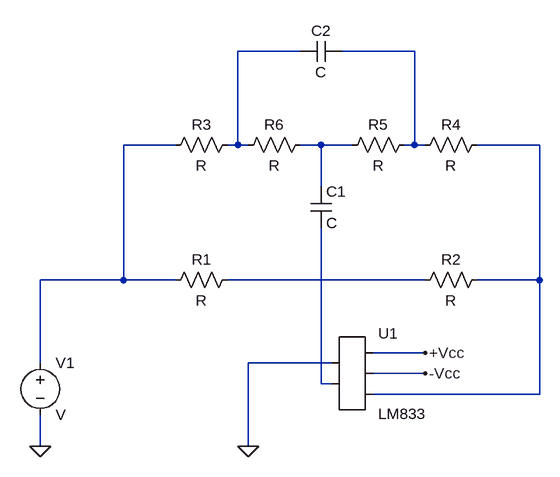
[diagram p0: schematic Con LM833.asc]
Con LM833.asc, the LTspice schematic file:
Version 4
SHEET 1 880 680
WIRE 80 -352 -16 -352
WIRE 256 -352 144 -352
WIRE -112 -208 -192 -208
WIRE -16 -208 -16 -352
WIRE -16 -208 -32 -208
WIRE 0 -208 -16 -208
WIRE 112 -208 80 -208
WIRE 160 -208 112 -208
WIRE 256 -208 256 -352
WIRE 256 -208 240 -208
WIRE 272 -208 256 -208
WIRE 448 -208 352 -208
WIRE 112 -144 112 -208
WIRE -192 0 -192 -208
WIRE -192 0 -320 0
WIRE -112 0 -192 0
WIRE 272 0 -32 0
WIRE 448 0 448 -208
WIRE 448 0 352 0
WIRE 272 112 192 112
WIRE -320 128 -320 0
WIRE 128 128 0 128
WIRE 272 144 192 144
WIRE 112 160 112 -80
WIRE 128 160 112 160
WIRE 448 176 448 0
WIRE 448 176 192 176
WIRE -320 256 -320 208
WIRE 0 256 0 128
FLAG -320 256 0
FLAG 0 256 0
FLAG 272 112 +Vcc
FLAG 272 144 -Vcc
SYMBOL AutoGenerated\\LM833 160 144 R0
SYMATTR InstName U1
SYMBOL res -16 -16 R90
WINDOW 0 0 56 VBottom 2
WINDOW 3 32 56 VTop 2
SYMATTR InstName R1
SYMBOL res 368 -16 R90
WINDOW 0 0 56 VBottom 2
WINDOW 3 32 56 VTop 2
SYMATTR InstName R2
SYMBOL res -16 -224 R90
WINDOW 0 0 56 VBottom 2
WINDOW 3 32 56 VTop 2
SYMATTR InstName R3
SYMBOL res 368 -224 R90
WINDOW 0 0 56 VBottom 2
WINDOW 3 32 56 VTop 2
SYMATTR InstName R4
SYMBOL res 256 -224 R90
WINDOW 0 0 56 VBottom 2
WINDOW 3 32 56 VTop 2
SYMATTR InstName R5
SYMBOL res 96 -224 R90
WINDOW 0 0 56 VBottom 2
WINDOW 3 32 56 VTop 2
SYMATTR InstName R6
SYMBOL cap 96 -144 R0
SYMATTR InstName C1
SYMBOL cap 144 -368 R90
WINDOW 0 0 32 VBottom 2
WINDOW 3 32 32 VTop 2
SYMATTR InstName C2
SYMBOL voltage -320 112 R0
SYMATTR InstName V1

The netlist it stands for:
* Con LM833.asc
* U1: LM833 (symbol AutoGenerated\LM833 not available, pins judged from their places): pin1=0 pin2=N007 pin3=+Vcc pin4=-Vcc pin5=N005
R1 N006 N003 R
R2 N005 N006 R
R3 N001 N003 R
R4 N005 N002 R
R5 N002 N004 R
R6 N004 N001 R
C1 N004 N007 C
C2 N002 N001 C
V1 N003 0 V
.backanno
.end